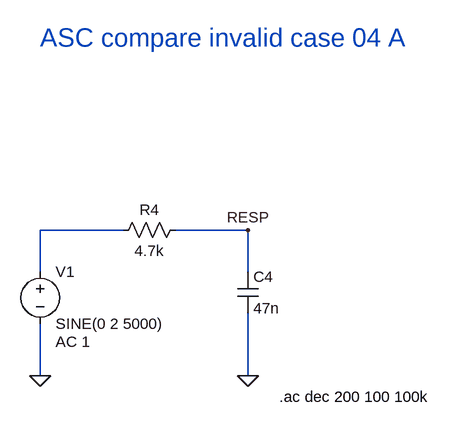
[diagram p0: schematic invalid_case_04_a.asc]
invalid_case_04_a.asc, the LTspice schematic file:
Version 4.1
SHEET 1 1164 680
WIRE 208 48 80 48
WIRE 400 48 288 48
WIRE 80 112 80 48
WIRE 400 112 400 48
WIRE 80 272 80 192
WIRE 400 272 400 176
FLAG 80 272 0
FLAG 400 272 0
FLAG 400 48 RESP
SYMBOL voltage 80 96 R0
WINDOW 123 24 124 Left 2
WINDOW 39 0 0 Left 2
SYMATTR Value2 AC 1
SYMATTR InstName V1
SYMATTR Value SINE(0 2 5000)
SYMBOL res 304 32 R90
WINDOW 0 0 56 VBottom 2
WINDOW 3 32 56 VTop 2
SYMATTR InstName R4
SYMATTR Value 4.7k
SYMBOL cap 384 112 R0
SYMATTR InstName C4
SYMATTR Value 47n
TEXT 448 304 Left 2 !.ac dec 200 100 100k
TEXT 80 -248 Left 4 ;ASC compare invalid case 04 A

The netlist it stands for:
* invalid_case_04_a.asc
V1 N001 0 SINE(0 2 5000) AC 1
R4 RESP N001 4.7k
C4 RESP 0 47n
.ac dec 200 100 100k
* ASC compare invalid case 04 A
.backanno
.end